# Altium schematic sheet microcontroller.SchDoc
size A3; SheetNumber: 1; SheetTotal: 4
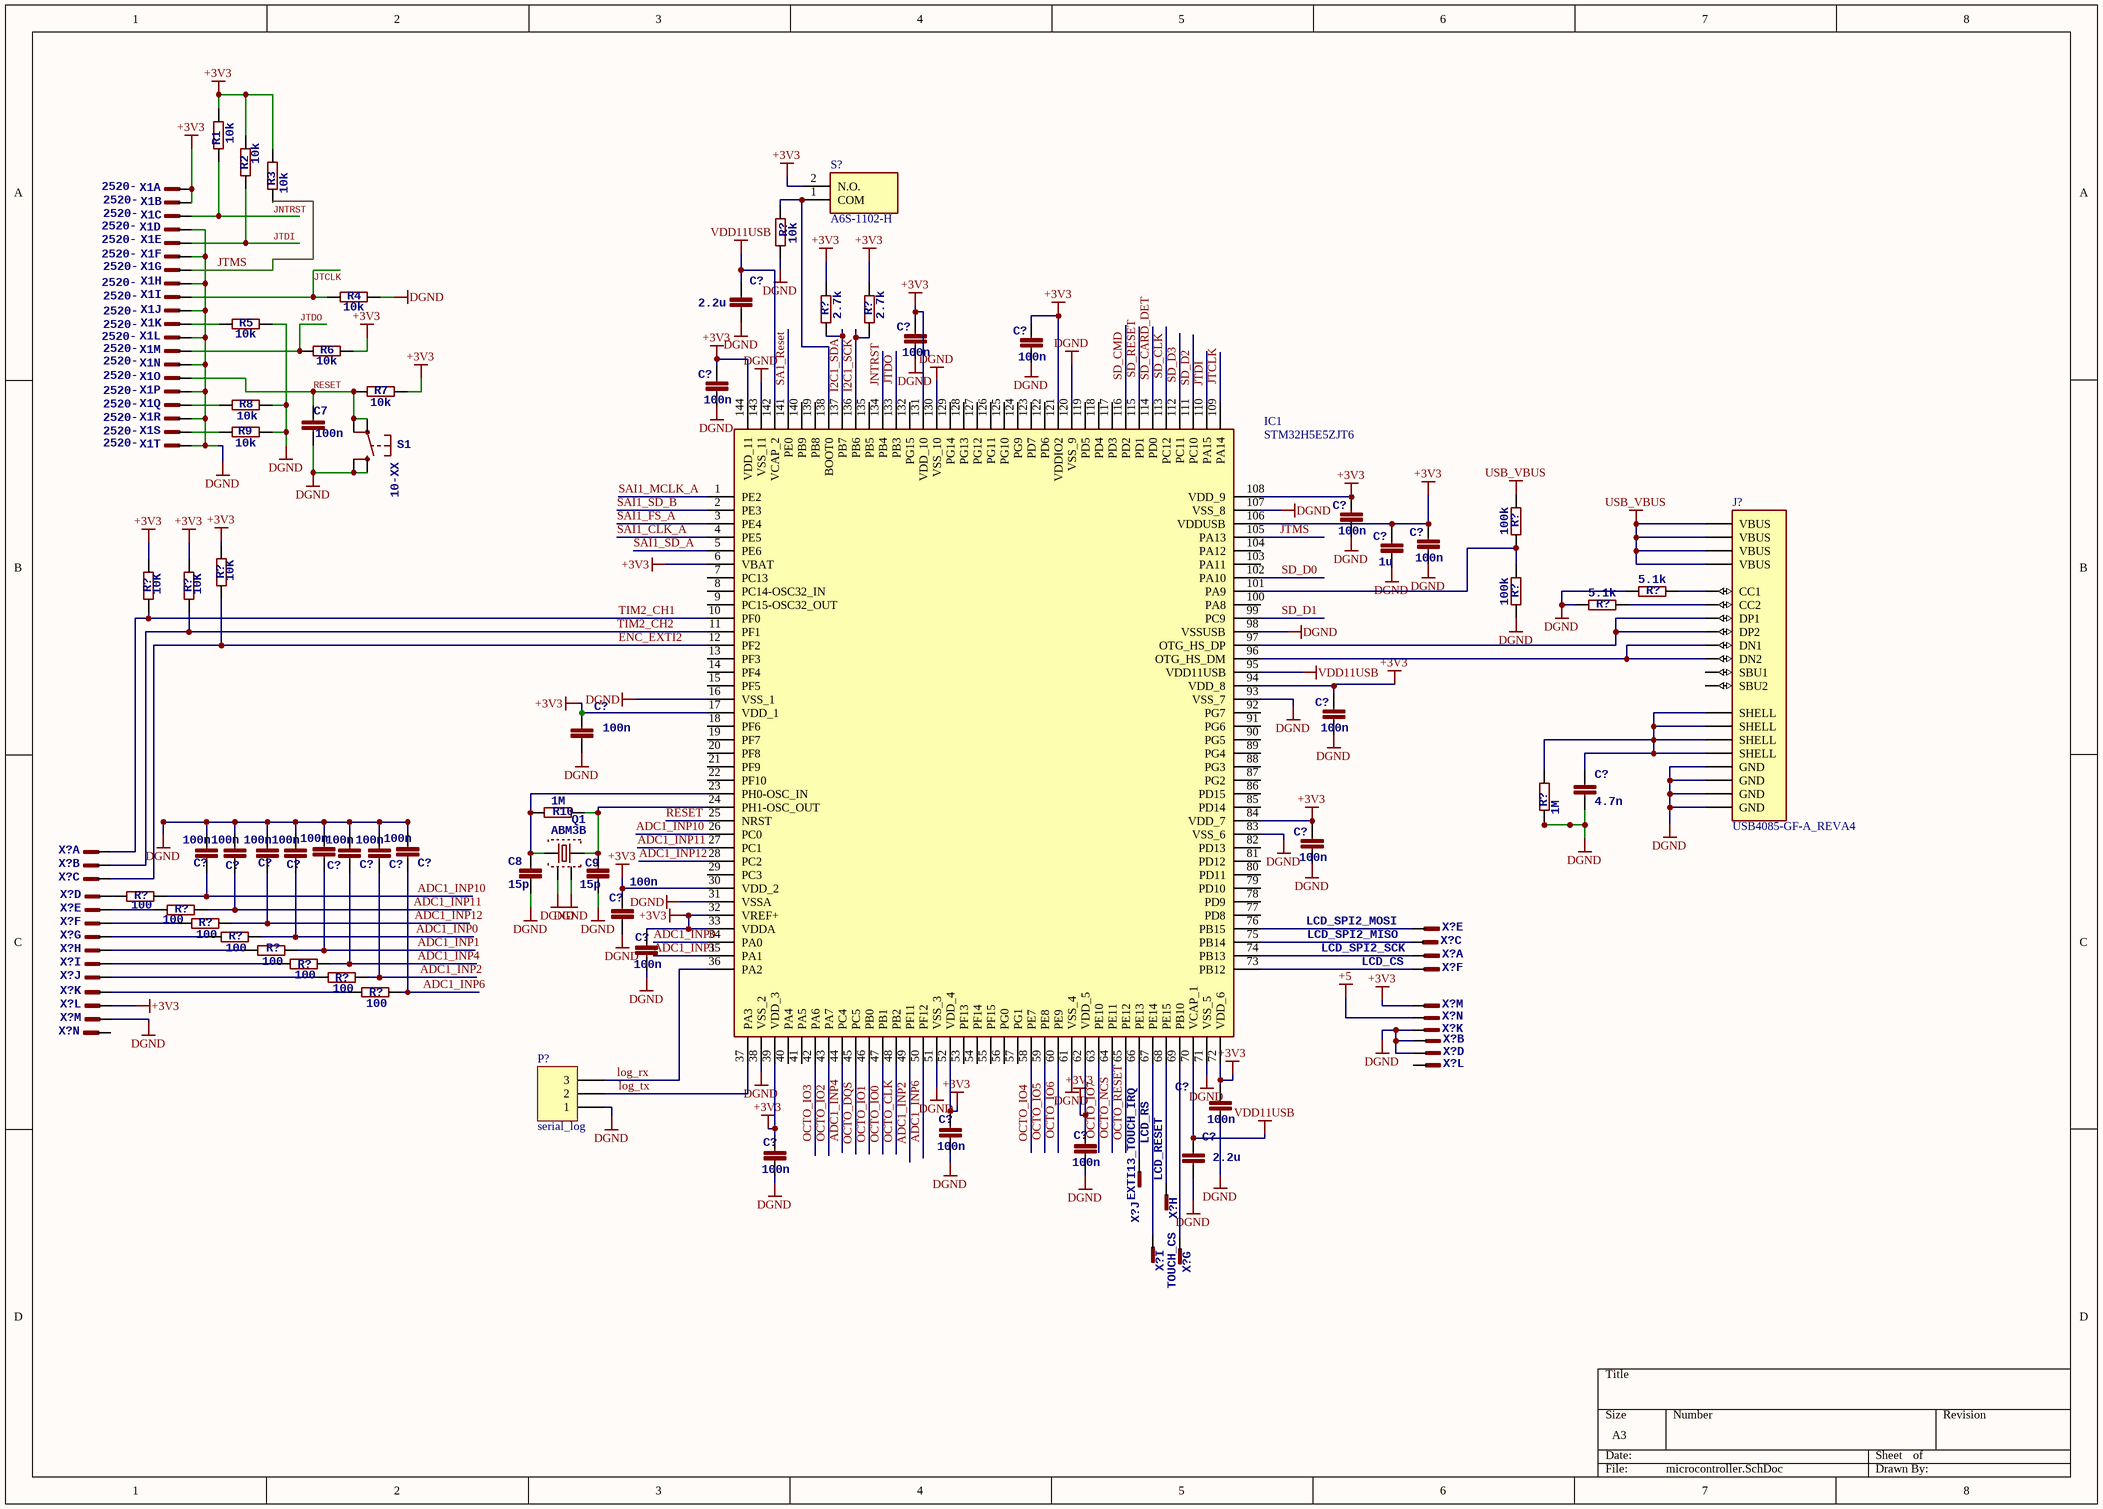
[diagram p0: microcontroller.SchDoc]

## Parts
(Parts that share a designator on the sheet are numbered #1, #2 ... from top to bottom, then left to right.)
C7  100n  [C0402]
C8  15p  [C0402]
C9  15p  [C0402]
C?#1  2.2u  [C0805]
C?#2  100n  [C0402]
C?#3  100n  [C0402]
C?#4  100n  [C0402]
C?#5  100n  [C0402]
C?#6  1u  [C0402]
C?#7  100n  [C0402]
C?#8  100n  [C0402]
C?#9  100n  [C0402]
C?#10  4.7n  [C0805]
C?#11  100n  [C0402]
C?#12  100n  [C0402]
C?#13  100n  [C0402]
C?#14  100n  [C0402]
C?#15  100n  [C0402]
C?#16  100n  [C0402]
C?#17  100n  [C0402]
C?#18  100n  [C0402]
C?#19  100n  [C0402]
C?#20  100n  [C0402]
C?#21  100n  [C0402]
C?#22  100n  [C0402]
C?#23  100n  [C0402]
C?#24  100n  [C0402]
C?#25  100n  [C0402]
C?#26  2.2u  [C0805]
IC1  STM32H5E5ZJT6  [QFP50P2200X2200X160-144N]
J?  USB4085-GF-A_REVA4  [GCT_USB4085-GF-A_REVA4]
P?  serial_log  [HDR1X3]
Q1  ABM3B  [ABM3B]
R1  10k  [R0805]
R2  10k  [R0805]
R3  10k  [R0805]
R4  10k  [R0805]
R5  10k  [R0805]
R6  10k  [R0805]
R7  10k  [R0805]
R8  10k  [R0805]
R9  10k  [R0805]
R10  1M  [R0402]
R?#1  10k  [R0805]
R?#2  2.7k  [R0805]
R?#3  2.7k  [R0805]
R?#4  100k  [R0805]
R?#5  10K  [R0805]
R?#6  10K  [R0805]
R?#7  10K  [R0805]
R?#8  100k  [R0805]
R?#9  5.1k  [R0805]
R?#10  5.1k  [R0805]
R?#11  1M  [R0805]
R?#12  100  [R0805]
R?#13  100  [R0805]
R?#14  100  [R0805]
R?#15  100  [R0805]
R?#16  100  [R0805]
R?#17  100  [R0805]
R?#18  100  [R0805]
R?#19  100  [R0805]
S1  10-XX  [B3F-10XX]
S?  A6S-1102-H  [A6S1102H]
X1  2520-  [PAK100/2500-20]  (parts A,B,C,D,E,F,G,H,I,J,K,L,M,N,O,P,Q,R,S,T of 20)
X?#1  (no value)  [PAK100/2500-14]  (part A of 14)
X?#2  (no value)  [PAK100/2500-14]  (part B of 14)
X?#3  (no value)  [PAK100/2500-14]  (part C of 14)
X?#4  (no value)  [PAK100/2500-14]  (part D of 14)
X?#5  (no value)  [PAK100/2500-14]  (part E of 14)
X?#6  (no value)  [PAK100/2500-14]  (part F of 14)
X?#7  LCD_SPI2_MOSI  [PAK100/2500-14]  (part E of 14)
X?#8  (no value)  [PAK100/2500-14]  (part G of 14)
X?#9  LCD_SPI2_MISO  [PAK100/2500-14]  (part C of 14)
X?#10  (no value)  [PAK100/2500-14]  (part H of 14)
X?#11  LCD_SPI2_SCK  [PAK100/2500-14]  (part A of 14)
X?#12  (no value)  [PAK100/2500-14]  (part I of 14)
X?#13  LCD_CS  [PAK100/2500-14]  (part F of 14)
X?#14  (no value)  [PAK100/2500-14]  (part J of 14)
X?#15  (no value)  [PAK100/2500-14]  (part K of 14)
X?#16  (no value)  [PAK100/2500-14]  (part L of 14)
X?#17  LCD_CS  [PAK100/2500-14]  (value not drawn)  (part M of 14)
X?#18  (no value)  [PAK100/2500-14]  (part M of 14)
X?#19  LCD_CS  [PAK100/2500-14]  (value not drawn)  (part N of 14)
X?#20  (no value)  [PAK100/2500-14]  (part N of 14)
X?#21  (no value)  [PAK100/2500-14]  (part K of 14)
X?#22  (no value)  [PAK100/2500-14]  (part B of 14)
X?#23  (no value)  [PAK100/2500-14]  (part D of 14)
X?#24  LCD_CS  [PAK100/2500-14]  (value not drawn)  (part L of 14)
X?#25  EXTI13_TOUCH_IRQ  [PAK100/2500-14]  (part J of 14)
X?#26  LCD_RESET  [PAK100/2500-14]  (part H of 14)
X?#27  LCD_RS  [PAK100/2500-14]  (part I of 14)
X?#28  TOUCH_CS  [PAK100/2500-14]  (part G of 14)

## Nets
+3V3: C?#2.1 C?#3.1 C?#4.1 C?#5.1 C?#6.1 C?#7.1 C?#8.1 C?#9.1 C?#11.1 C?#20.1 C?#21.1 C?#22.1 C?#23.1 C?#24.1 C?#25.1 IC1.6(VBAT) IC1.17(VDD_1) IC1.30(VDD_2) IC1.32(VREF+) IC1.33(VDDA) IC1.39(VDD_3) IC1.52(VDD_4) IC1.62(VDD_5) IC1.72(VDD_6) IC1.84(VDD_7) IC1.94(VDD_8) IC1.106(VDDUSB) IC1.108(VDD_9) IC1.121(VDDIO2) IC1.131(VDD_10) IC1.144(VDD_11) R1.2 R2.2 R3.2 R6.1 R7.1 R?#2.1 R?#3.1 R?#5.1 R?#6.1 R?#7.1 S?.2(N.O.) X1.1(KL) X1.2(KL) X?#16.12(KL) X?#17.13(KL)
+5: X?#19.14(KL)
DGND: C7.2 C8.2 C9.2 C?#1.2 C?#2.2 C?#3.2 C?#4.2 C?#5.2 C?#6.2 C?#7.2 C?#8.2 C?#9.2 C?#10.2 C?#11.2 C?#12.1 C?#13.1 C?#14.1 C?#15.1 C?#16.1 C?#17.1 C?#18.1 C?#19.1 C?#20.2 C?#21.2 C?#22.2 C?#23.2 C?#24.2 C?#25.2 C?#26.2 IC1.16(VSS_1) IC1.31(VSSA) IC1.38(VSS_2) IC1.51(VSS_3) IC1.61(VSS_4) IC1.71(VSS_5) IC1.83(VSS_6) IC1.93(VSS_7) IC1.98(VSSUSB) IC1.107(VSS_8) IC1.120(VSS_9) IC1.130(VSS_10) IC1.143(VSS_11) J?.A1(GND) J?.A12(GND) J?.B1(GND) J?.B12(GND) P?.1 Q1.P$2 Q1.P$4 R4.1 R5.1 R8.1 R9.1 R?#1.2 R?#8.2 R?#9.2 R?#10.2 R?#11.1 S1.1(S) S1.2(S1) X1.4(KL) X1.6(KL) X1.8(KL) X1.10(KL) X1.12(KL) X1.14(KL) X1.16(KL) X1.18(KL) X1.20(KL) X?#18.13(KL) X?#21.11(KL) X?#22.2(KL) X?#23.4(KL)
USB_VBUS: J?.A4(VBUS) J?.A9(VBUS) J?.B4(VBUS) J?.B9(VBUS) R?#4.1
VDD11USB: C?#1.1 C?#26.1 IC1.70(VCAP_1) IC1.95(VDD11USB) IC1.142(VCAP_2)
ADC1_INP0: C?#17.2 IC1.34(PA0) R?#15.1
ADC1_INP1: C?#12.2 IC1.35(PA1) R?#16.1
ADC1_INP2: C?#19.2 IC1.49(PF11) R?#18.1
ADC1_INP4: C?#18.2 IC1.44(PC4) R?#17.1
ADC1_INP6: C?#13.2 IC1.50(PF12) R?#19.1
ADC1_INP10: C?#14.2 IC1.26(PC0) R?#12.1
ADC1_INP11: C?#15.2 IC1.27(PC1) R?#13.1
ADC1_INP12: C?#16.2 IC1.28(PC2) R?#14.1
ENC_EXTI2: IC1.12(PF2) R?#5.2 X?#3.3(KL)
I2C1_SCK: IC1.136(PB6) R?#3.2
I2C1_SDA: IC1.137(PB7) R?#2.2
JNTRST: IC1.134(PB4) R1.1 X1.3(KL)
JTCLK: IC1.109(PA14) R4.2 X1.9(KL)
JTDI: IC1.110(PA15) R2.1 X1.5(KL)
JTDO: IC1.133(PB3) R6.2 X1.13(KL)
JTMS: IC1.105(PA13) R3.1 X1.7(KL)
log_rx: IC1.36(PA2) P?.3
log_tx: IC1.37(PA3) P?.2
OCTO_CLK: IC1.48(PB2)
OCTO_DQS: IC1.45(PC5)
OCTO_IO0: IC1.47(PB1)
OCTO_IO1: IC1.46(PB0)
OCTO_IO2: IC1.43(PA7)
OCTO_IO3: IC1.42(PA6)
OCTO_IO4: IC1.58(PE7)
OCTO_IO5: IC1.59(PE8)
OCTO_IO6: IC1.60(PE9)
OCTO_IO7: IC1.63(PE10)
OCTO_NCS: IC1.64(PE11)
OCTO_RESET: IC1.65(PE12)
RESET: C7.1 IC1.25(NRST) R7.2 S1.3(P) S1.4(P1) X1.15(KL)
SA1_Reset: IC1.141(PE0)
SAI1_CLK_A: IC1.4(PE5)
SAI1_FS_A: IC1.3(PE4)
SAI1_MCLK_A: IC1.1(PE2)
SAI1_SD_A: IC1.5(PE6)
SAI1_SD_B: IC1.2(PE3)
SD_CARD_DET: IC1.114(PD0)
SD_CLK: IC1.113(PC12)
SD_CMD: IC1.116(PD2)
SD_D0: IC1.102(PA10)
SD_D1: IC1.99(PC9)
SD_D2: IC1.111(PC10)
SD_D3: IC1.112(PC11)
SD_RESET: IC1.115(PD1)
TIM2_CH1: IC1.10(PF0) R?#6.2 X?#1.1(KL)
TIM2_CH2: IC1.11(PF1) R?#7.2 X?#2.2(KL)
NetC8_1: C8.1 IC1.23(PH0-OSC_IN) Q1.P$1 R10.2
NetC9_1: C9.1 IC1.24(PH1-OSC_OUT) Q1.P$3 R10.1
NetC?#10_1: C?#10.1 J?.S1(SHELL) J?.S2(SHELL) J?.S3(SHELL) J?.S4(SHELL) R?#11.2
NetIC1_66: IC1.66(PE13) X?#25.10(KL)
NetIC1_67: IC1.67(PE14) X?#27.9(KL)
NetIC1_68: IC1.68(PE15) X?#26.8(KL)
NetIC1_69: IC1.69(PB10) X?#28.7(KL)
NetIC1_73: IC1.73(PB12) X?#13.6(KL)
NetIC1_74: IC1.74(PB13) X?#11.1(KL)
NetIC1_75: IC1.75(PB14) X?#9.3(KL)
NetIC1_76: IC1.76(PB15) X?#7.5(KL)
NetIC1_96: IC1.96(OTG_HS_DM) J?.A7(DN1) J?.B7(DN2)
NetIC1_97: IC1.97(OTG_HS_DP) J?.A6(DP1) J?.B6(DP2)
NetIC1_101: IC1.101(PA9) R?#4.2 R?#8.1
NetIC1_138: IC1.138(BOOT0) R?#1.1 S?.1(COM)
NetJ?_A5: J?.A5(CC1) R?#9.1
NetJ?_B5: J?.B5(CC2) R?#10.1
NetR5_2: R5.2 X1.11(KL)
NetR8_2: R8.2 X1.17(KL)
NetR9_2: R9.2 X1.19(KL)
NetR?#12_2: R?#12.2 X?#4.4(KL)
NetR?#13_2: R?#13.2 X?#5.5(KL)
NetR?#14_2: R?#14.2 X?#6.6(KL)
NetR?#15_2: R?#15.2 X?#8.7(KL)
NetR?#16_2: R?#16.2 X?#10.8(KL)
NetR?#17_2: R?#17.2 X?#12.9(KL)
NetR?#18_2: R?#18.2 X?#14.10(KL)
NetR?#19_2: R?#19.2 X?#15.11(KL)

Not connected (* = marked no-connect by the designer): IC1 7(PC13) 8(PC14-OSC32_IN) 9(PC15-OSC32_OUT) 13(PF3) 14(PF4) 15(PF5) 18(PF6) 19(PF7) 20(PF8) 21(PF9) 22(PF10) 29(PC3) 40(PA4) 41(PA5) 53(PF13) 54(PF14) 55(PF15) 56(PG0) 57(PG1) 77(PD8) 78(PD9) 79(PD10) 80(PD11) 81(PD12) 82(PD13) 85(PD14) 86(PD15) 87(PG2) 88(PG3) 89(PG4) 90(PG5) 91(PG6) 92(PG7) 100(PA8) 103(PA11) 104(PA12) 117(PD3) 118(PD4) 119(PD5) 122(PD6) 123(PD7) 124(PG9) 125(PG10) 126(PG11) 127(PG12) 128(PG13) 129(PG14) 132(PG15) 135(PB5) 139(PB8) 140(PB9); J? A8(SBU1) B8(SBU2); X?#20 14(KL); X?#24 12(KL)

## Library data of the parts
C7-C9 C?#1-C?#9 C?#11-C?#26 = C-EUC0402: <B>CAPACITOR</B>, European symbol; SPICEPREFIX: C
C?#10 = C-EUC0805: <B>CAPACITOR</B>, European symbol; SPICEPREFIX: C
IC1 = STM32H5E5ZJT6: Integrated Circuit; Manufacturer_Name: STMicroelectronics; Datasheet Link: https://www.st.com/resource/en/datasheet/stm32h5e4vj.pdf; Height: 1.6mm; Manufacturer_Part_Number: STM32H5E5ZJT6; Arrow Part Number: STM32H5E5ZJT6; Arrow Price/Stock: https://www.arrow.com/en/products/stm32h5e5zjt6/stmicroelectronics.html?utm_currency=USD&region=nac
J? = USB4085-GF-A_REVA4: USB-C (USB TYPE-C) USB 2.0 Receptacle Connector 24 (16+8 Dummy) Position Through Hole, Right Angle, low cost, 3.46mm profile, 16 pin, horizontal, Top mount; MF: Global Connector Technology; SnapEDA_Link: https://www.snapeda.com/parts/USB4085-GF-A/Global+Connector+Technology/view-part/?ref=snap; Package: None; MP: USB4085-GF-A; Check_prices: https://www.snapeda.com/parts/USB4085-GF-A/Global+Connector+Technology/view-part/?ref=eda; Purchase-URL: https://pricing.snapeda.com/search/part/USB4085-GF-A/?ref=eda; Price: None; Value: *; Availability: In Stock
P? = Header 3: Header, 3-Pin; LatestRevisionDate: 17-Jul-2002; LatestRevisionNote: Re-released for DXP Platform.; Publisher: Altium Limited
R1-R9 R?#1-R?#19 = R-EU_R0805: <B>RESISTOR</B>, European symbol
R10 = R-EU_R0402: <B>RESISTOR</B>, European symbol
S1 = 10-XX: <b>OMRON SWITCH</b>; MPN: B3F-1000; OC_FARNELL: 176432; OC_NEWARK: 36M3542
S? = A6S-1102-H: Switch; Manufacturer_Name: OMRON Electronics; Datasheet Link: https://components.omron.com/us-en/sites/components.omron.com.us/files/datasheet_pdf/A211-E1.pdf; Height: 3.8mm; Manufacturer_Part_Number: A6S-1102-H; Mouser Part Number: 653-A6S-1102-H; Mouser Price/Stock: https://www.mouser.co.uk/ProductDetail/Omron-Electronics/A6S-1102-H?qs=FFtkVBg2Ai6emF35RthuRw%3D%3D; Arrow Part Number: A6S-1102-H; Arrow Price/Stock: https://www.arrow.com/en/products/a6s1102h/omron?region=nac
X1 = 2520-: <b>3M (TM) Pak 100 4-Wall Header</b><p> / Source: 3M; OC_FARNELL: unknown; OC_NEWARK: unknown
X?#1-X?#28 = 2514-: OC_FARNELL: unknown; OC_NEWARK: unknown